# EAGLE schematic MCP23017 16x2 LCD_Pi (EAGLE 7.3.0)
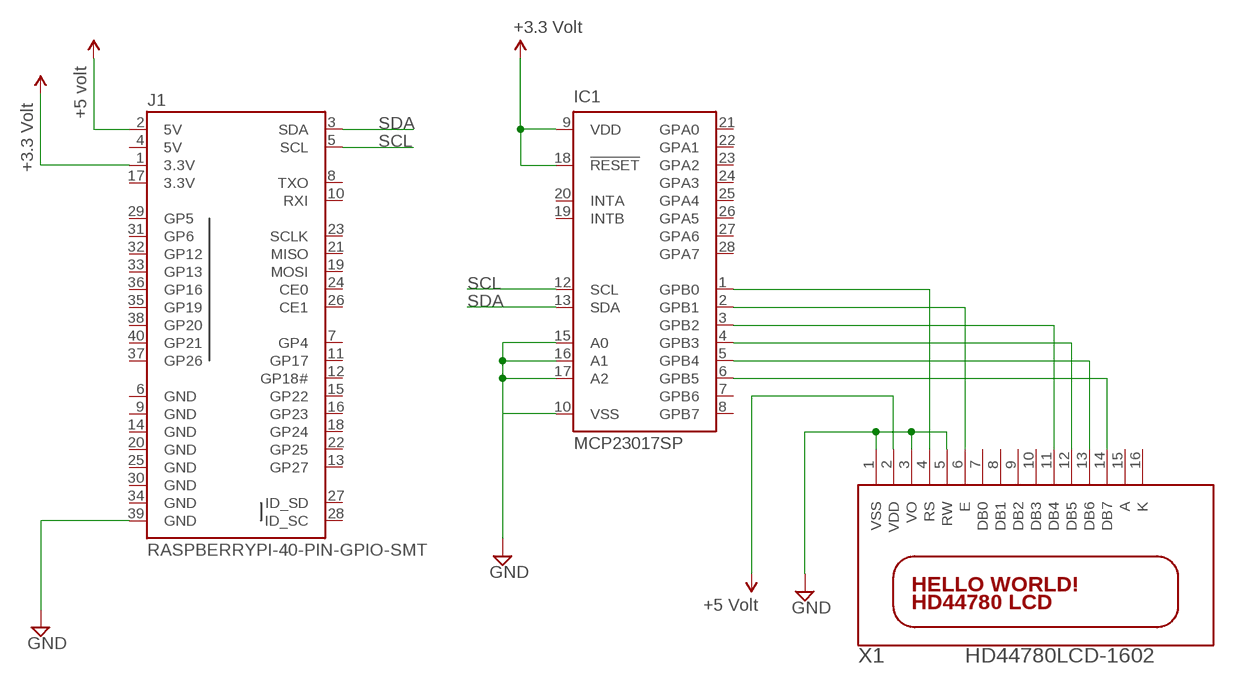
[diagram p0: schematic, sheet 1]

## Parts
IC1  MCP23017SP  [DIL28-3]
J1  RASPBERRYPI-40-PIN-GPIO-SMT  [2X20-SHROUDED-SMT]
X1  HD44780LCD-1602  [LCD1602]

## Nets
GND: IC1.10(VSS) IC1.15(A0) IC1.16(A1) IC1.17(A2) J1.39(GND) X1.1(VSS) X1.3(VO) X1.5(RW)
N$1: IC1.1(GPB0) X1.4(RS)
N$2: IC1.2(GPB1) X1.6(E)
N$3: IC1.3(GPB2) X1.11(DB4)
N$4: IC1.4(GPB3) X1.12(DB5)
N$5: IC1.5(GPB4) X1.13(DB6)
N$6: IC1.6(GPB5) X1.14(DB7)
SCL: IC1.12(SCL) J1.5(SCL)
SDA: IC1.13(SDA) J1.3(SDA)
VCC: IC1.9(VDD) IC1.18(!RESET) J1.1(3.3V) J1.2(5V) ; supply symbol labelled +3.3 Volt, +5 volt
VDD: X1.2(VDD) ; supply symbol labelled +5 Volt
Unconnected: IC1.7(GPB6) IC1.8(GPB7) IC1.19(INTB) IC1.20(INTA) IC1.21(GPA0) IC1.22(GPA1) IC1.23(GPA2) IC1.24(GPA3) IC1.25(GPA4) IC1.26(GPA5) IC1.27(GPA6) IC1.28(GPA7) J1.7(GP4) J1.8(TXO) J1.10(RXI) J1.11(GP17) J1.12(GP18#) J1.13(GP27) J1.15(GP22) J1.16(GP23) J1.18(GP24) J1.19(MOSI) J1.21(MISO) J1.22(GP25) J1.23(SCLK) J1.24(CE0) J1.26(CE1) J1.27(ID_SD) J1.28(ID_SC) J1.29(GP5) J1.31(GP6) J1.32(GP12) J1.33(GP13) J1.35(GP19) J1.36(GP16) J1.37(GP26) J1.38(GP20) J1.40(GP21) X1.7(DB0) X1.8(DB1) X1.9(DB2) X1.10(DB3) X1.15(A) X1.16(K)

## Power pins joined to a net without a drawn wire
3.3V: J1.17(3.3V)
5V: J1.4(5V)
GND: J1.6(GND) J1.9(GND) J1.14(GND) J1.20(GND) J1.25(GND) J1.30(GND) J1.34(GND)

## Library data of the parts
IC1 = microchip:MCP23017: http://ww1.microchip.com/downloads/en/DeviceDoc/21952a.pdf Source: http://ww1.microchip.com/downloads/en/DeviceDoc/21952a.pdf; MF: MICROCHIP; MPN: MCP23017-E/SP; OC_FARNELL: 1332088; OC_NEWARK: 31K2959
J1 = SparkFun-Boards:RASPBERRYPI-40-PIN-GPIO: Second Generation Raspberry Pi GPIO Header 2x20 pin connector, as found on B, B+, A+ models.; PROD_ID: CONN-13143
X1 = adafruit:HD44780LCD: HD44780 LCD Standard character type LCDs, available in sizes from 8x1 to 40x4!